# EAGLE design TEST_PCB (EAGLE 9.0.1)
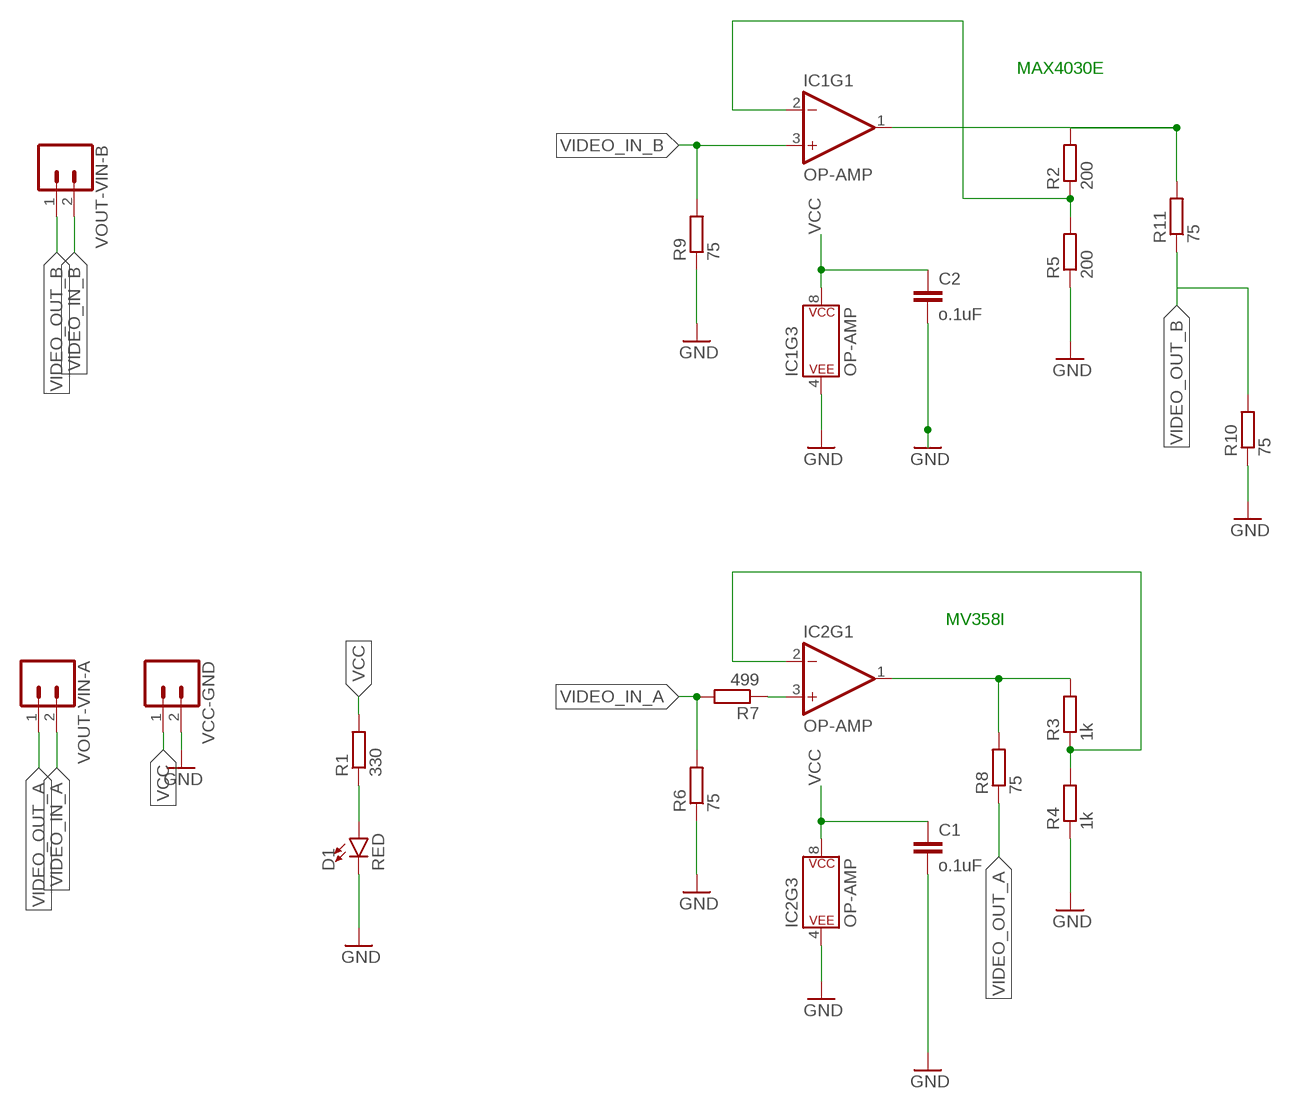
[diagram p0: schematic, sheet 1]

## Parts
C1  o.1uF  C-EUC0603K  [C0603K]
C2  o.1uF  C-EUC0603K  [C0603K]
D1  RED  LED-RED1206  [LED-1206]
IC1  OP-AMP  OPAMP-DUALU  [SO08]
IC2  OP-AMP  OPAMP-DUALU  [SO08]
R1  330  R-EU_R0603  [R0603]
R2  200  R-EU_R0603  [R0603]
R3  1k  R-EU_R0603  [R0603]
R4  1k  R-EU_R0603  [R0603]
R5  200  R-EU_R0603  [R0603]
R6  75  R-EU_R0603  [R0603]
R7  499  R-EU_R0603  [R0603]
R8  75  R-EU_R0603  [R0603]
R9  75  R-EU_R0603  [R0603]
R10  75  R-EU_R0603  [R0603]
R11  75  R-EU_R0603  [R0603]
VCC-GND  CONN_02  [1X02]
VOUT-VIN-A  CONN_02  [1X02]
VOUT-VIN-B  CONN_02  [1X02]

## Nets
1: IC1.1(OUT) R2.2 R11.2
75: IC2.1(OUT) R3.2 R8.2
GND: C1.2 C2.2 D1.C IC1.4(P$V-) IC2.4(P$V-) R4.1 R5.1 R6.1 R9.1 R10.1 VCC-GND.2
N$1: IC1.2(-IN) R2.1 R5.2
N$2: D1.A R1.1
N$4: IC2.2(-IN) R3.1 R4.2
N$5: IC2.3(+IN) R7.1
VCC: C1.1 C2.1 IC1.8(P$V+) IC2.8(P$V+) R1.2 VCC-GND.1
VIDEO_IN_A: R6.2 R7.2 VOUT-VIN-A.2
VIDEO_IN_B: IC1.3(+IN) R9.2 VOUT-VIN-B.2
VIDEO_OUT_A [medium]: R8.1 VOUT-VIN-A.1
VIDEO_OUT_B [medium]: R10.2 R11.1 VOUT-VIN-B.1
Unconnected: IC1.5(+IN) IC1.6(-IN) IC1.7(OUT) IC2.5(+IN) IC2.6(-IN) IC2.7(OUT)

## Notes on the sheet
- MAX4030E
- MV358I

## Library data of the parts
C1 C2 = rcl:C-EU: CAPACITOR, European symbol; SPICEPREFIX: C
D1 = SparkFun-LED:LED-RED: Red SMD LED Used in manufacturing of most products at SparkFun Packages: 0603 - SMD 0603 package [Product Link] <http://docs.avagotech.com/docs/AV02-0551EN> 0603 SMART - SMD 0603 SMART package ( more efficient and expensive)[Product Link] <http://www.osram-os.com/Graphics/XPic2/00077099_0.pdf> 1206 - SMD1206 package [Product Link] <https://www.sparkfun.com/datasheets/DevTools/LilyPad/Q150OVS4.pdff> SparkFun Products: Pro Mini 328 -5V <https://www.sparkfun.com/products/821> RedBoard <https://www.sparkfun.com/products/12757> IOIO-OTG <https://www.sparkfun.com/products/13613>; PROD_ID: DIO-09912
IC1 IC2 = SparkFun-IC-Amplifiers:OPAMP-DUAL: Generic op-amp footprint This component is for the standard 358 pinning of a dual op-amp From the LM358 datasheet: Pin 1: Output A Pin 2: Inverting Input A Pin 3: Non-Inverting Input A Pin 4: Gnd Pin 5: Non-Inverting Input B Pin 6: Inverting Input B Pin 7: Output B Pin 8: V+; PROD_ID: NA-XXXXX
R1-R11 = resistor:R-EU_: RESISTOR, European symbol
VCC-GND VOUT-VIN-A VOUT-VIN-B = SparkFun-Connectors:CONN_02: Multi connection point. Often used as Generic Header-pin footprint for 0.1 inch spaced/style header connections On any of the 0.1 inch spaced packages, you can populate with these: Break Away Headers - Straight <https://www.sparkfun.com/products/116> (PRT-00116) Break Away Male Headers - Right Angle <https://www.sparkfun.com/products/553> (PRT-00553) Female Headers <https://www.sparkfun.com/products/115> (PRT-00115) Break Away Headers - Machine Pin <https://www.sparkfun.com/products/117> (PRT-00117) Break Away Female Headers - Swiss Machine Pin <https://www.sparkfun.com/products/743> (PRT-00743) For SCREWTERMINALS and SPRING TERMINALS visit here: Screw Terimnals on SparkFun.com <https://www.sparkfun.com/search/results?term=Screw+Terminals> (5mm/3.5mm/2.54mm spacing) This device is also useful as a general connection point to wire up your design to another part of your project. Our various solder wires solder well into these plated through hole pads. Hook-Up Wire - Assortment (Stranded, 22 AWG) <https://www.sparkfun.com/products/11375> (PRT-11375) Hook-Up Wire - Assortment (Solid Core, 22 AWG) <https://www.sparkfun.com/products/11367> (PRT-11367) View the entire wire category on our website here <https://www.sparkfun.com/categories/141> Special notes: Molex polarized connector foot print use with: PRT-08233 with associated crimp pins and housings. 2.54_SCREWTERM for use with PRT-10571. 3.5mm Screw Terminal footprints for PRT-08084 5mm Screw Terminal footprints for use with PRT-08432

## Net classes
0 default: width 0.4 mm, drill 0.3 mm, clearance 0.3 mm
1 thin: width 0.4 mm, drill 0.3 mm, clearance 0.3 mm
2 medium: width 0.4 mm, drill 0.3 mm, clearance 0.3 mm
3 d_cl: width 0.4 mm, drill 0.3 mm, clearance 0.3 mm

## Board
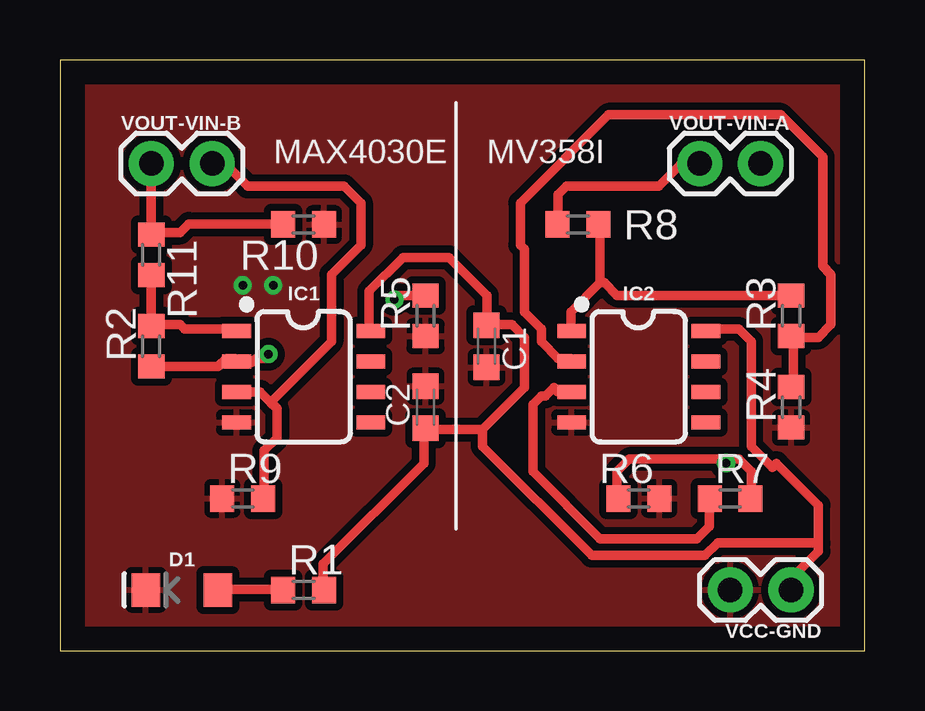
[diagram p1: board, top side]
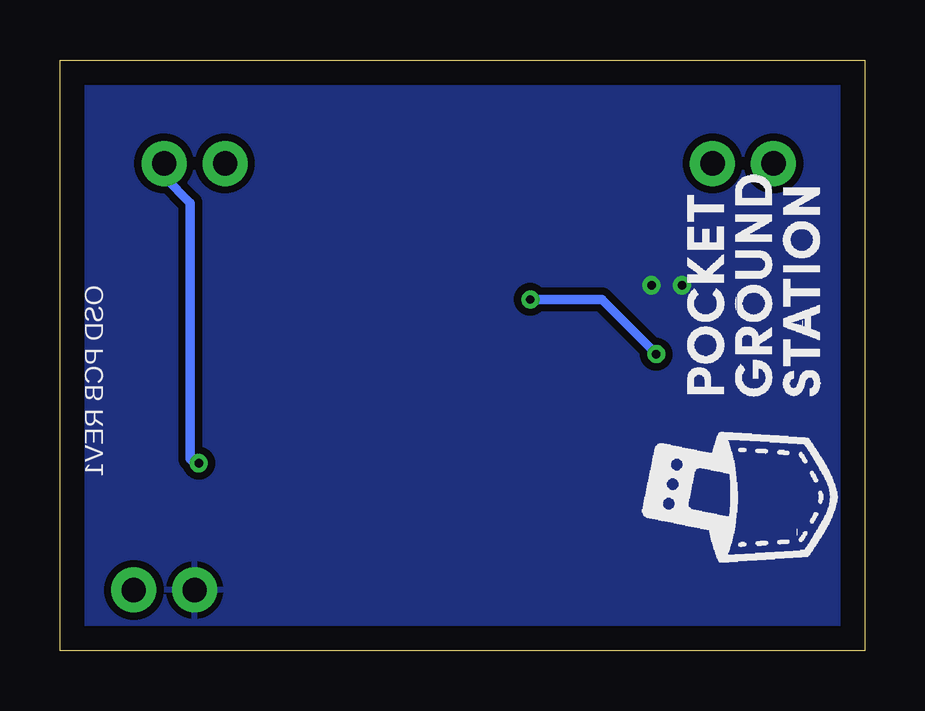
[diagram p2: board, bottom side, seen from below]

Size 33.55 x 24.64 mm. Coordinates in mm from the lower left corner, seen from the top.
Outline: 33.55,0 33.55,24.64 0,24.64 0,0 33.55,0
Copper layers (1*16): Top 0.035mm / dielectric 1.5mm / Bottom 0.035mm
Design rules "PCB Albert *": minimum track width 0.15mm, minimum drill 0.35mm, track to track 0.205mm, track to pad 0.205mm, pad to pad 0.205mm, via to via 0.205mm, smd to smd 6mil, copper to edge 40mil, drill to drill 6mil, minimum pad ring 10mil, minimum via ring 8mil, stop-mask expansion 4mil, vias tented up to drill 2mm, thermal gap 10mil

### Footprints (pad centres in the part's own frame; a part is rotated, then mirrored left to right if it is on the bottom)
C0603K = smd 1.05 x 1.08: 1 -0.875,0; 2 0.875,0
LED-1206 = smd 1.2 x 1.4: A -1.5,0; C 1.5,0
SO08 = smd 0.6 x 1.2: 1 -1.905,-2.8; 2 -0.635,-2.8; 3 0.635,-2.8; 4 1.905,-2.8; 5 1.905,2.8; 6 0.635,2.8; 7 -0.635,2.8; 8 -1.905,2.8
R0603 = smd 1 x 1.1: 1 -0.85,0; 2 0.85,0
1X02 = drill 1.016 pad 1.88: 1 0,0; 2 2.54,0

### Placement (x,y rotation side)
C1  17.78,12.7 270 top
C2  15.24,10.16 90 top
D1  5.08,2.54 180 top
IC1  10.16,11.43 270 top
IC2  24.13,11.43 270 top
R1  10.16,2.54 0 top
R2  3.81,12.7 90 top
R3  30.48,13.97 90 top
R4  30.48,10.16 90 top
R5  15.24,13.97 90 top
R6  24.13,6.35 180 top
R7  27.94,6.35 0 top
R8  21.59,17.78 0 top
R9  7.62,6.35 0 top
R10  10.16,17.78 180 top
R11  3.81,16.51 270 top
VCC-GND  30.48,2.54 180 top
VOUT-VIN-A  26.67,20.32 0 top
VOUT-VIN-B  3.81,20.32 0 top

### Tracks (layer width: path | path; a pad name or v marks a point on that pad's centre or on a via)
1
  Top 0.4: R11.2 3.79,15.53 3.79,13.6 R2.2 3.97,13.6 5.02,13.6 5.2,13.42 | 5.2,13.42 7.3,13.42 | 7.3,13.42 IC1.1 | 5.2,13.42 7.3,13.42
75
  Top 0.4: 22.52,15.35 22.52,17.62 R8.2 | 22.52,15.35 21.3,14.12 21.3,13.42 IC2.1 | R3.2 30.4,14.83 23.22,14.83 22.7,15.35 22.52,15.35
GND  (via drill 0.35)
  other vias: 8.89,15.24 7.62,15.24
  pour Bottom: -12.7,25.4 -12.7,-2.54 35.56,-2.54 35.56,25.4
  pour Top: -13.97,26.67 35.56,26.67 35.56,-2.54 -13.97,-2.54
N$1  (via drill 0.35)
  Top 0.4: R2.1 6.59,11.85 6.95,12.2 7.3,12.2 IC1.2 7.47,12.03 8,12.03 8.17,12.2 8.52,12.2 v8.7,12.38 | v13.95,14.65 14.12,14.83 15.17,14.83 R5.2
  Bottom 0.4: v13.95,14.65 10.97,14.65 v8.7,12.38
N$2
  Top 0.4: R1.1 9.22,2.58 6.59,2.58 D1.A
N$4
  Top 0.4: R4.2 30.57,11.15 30.57,13.08 R3.1 30.57,13.25 30.74,13.25 30.92,13.08 31.62,13.08 32.15,13.6 32.15,15.7 31.8,16.05 31.8,20.6 30.05,22.35 22.87,22.35 19.2,18.67 19.2,16.92 19.37,16.75 19.37,14.12 20.07,13.42 20.07,12.9 20.77,12.2 21.3,12.2 IC2.2
N$5
  Top 0.4: R7.1 27.07,6.25 27.07,5.2 26.55,4.68 22.52,4.68 19.72,7.48 19.72,10.28 20.07,10.62 20.25,10.62 20.59,10.98 20.77,10.8 21.3,10.8 IC2.3
VCC
  Top 0.4: 31.62,4.5 31.62,4.15 30.57,3.1 30.57,2.58 VCC-GND.1 | 31.62,4.5 31.62,6.08 29.87,7.83 29.7,7.65 28.82,8.53 28.82,12.9 28.3,13.42 27.07,13.42 IC2.8 | R1.2 10.97,2.58 10.97,3.62 15.17,7.83 15.17,9.23 C2.1 15.34,9.23 17.62,9.23 | 17.62,9.23 19.37,10.98 19.37,13.08 18.84,13.6 17.8,13.6 C1.1 17.62,13.6 17.62,13.78 17.8,13.95 17.8,14.83 16.22,16.4 14.3,16.4 12.89,15 12.89,13.42 IC1.8 | 31.62,4.5 27.42,4.5 26.9,3.98 22.17,3.98 17.62,8.53 17.62,9.23
VIDEO_IN_A  (via drill 0.35)
  Top 0.4: 27.77,8 28.3,8 28.82,7.48 28.82,6.43 R7.2 | 27.77,8 23.74,8 23.22,7.48 23.22,6.43 R6.2 | v27.77,7.83 27.77,8
  Bottom 0.4: v27.77,7.83 27.95,7.83 28.12,8 28.12,18.67 29.17,19.73 29.17,20.25 VOUT-VIN-A.2
VIDEO_IN_B
  Top 0.4: 8.78,10.36 8.34,10.8 7.47,10.8 IC1.3 | 8.78,10.36 9.05,10.1 9.05,8.88 8.52,8.35 8.52,6.43 R9.2 | 8.78,10.36 11.32,12.9 11.32,15.7 12.55,16.92 12.55,18.67 11.84,19.38 7.82,19.38 6.95,20.25 6.42,20.25 VOUT-VIN-B.2
VIDEO_OUT_A
  Top 0.4: R8.1 20.77,17.8 20.77,19.03 21.12,19.38 24.97,19.38 25.84,20.25 26.55,20.25 VOUT-VIN-A.1
VIDEO_OUT_B
  Top 0.4: VOUT-VIN-B.1 3.79,20.25 3.79,17.45 R11.1 3.97,17.45 5.02,17.45 5.37,17.8 9.22,17.8 R10.2

### Text on the board
tNames: MAX4030E | MV358I
bNames: OSD PCB REV1